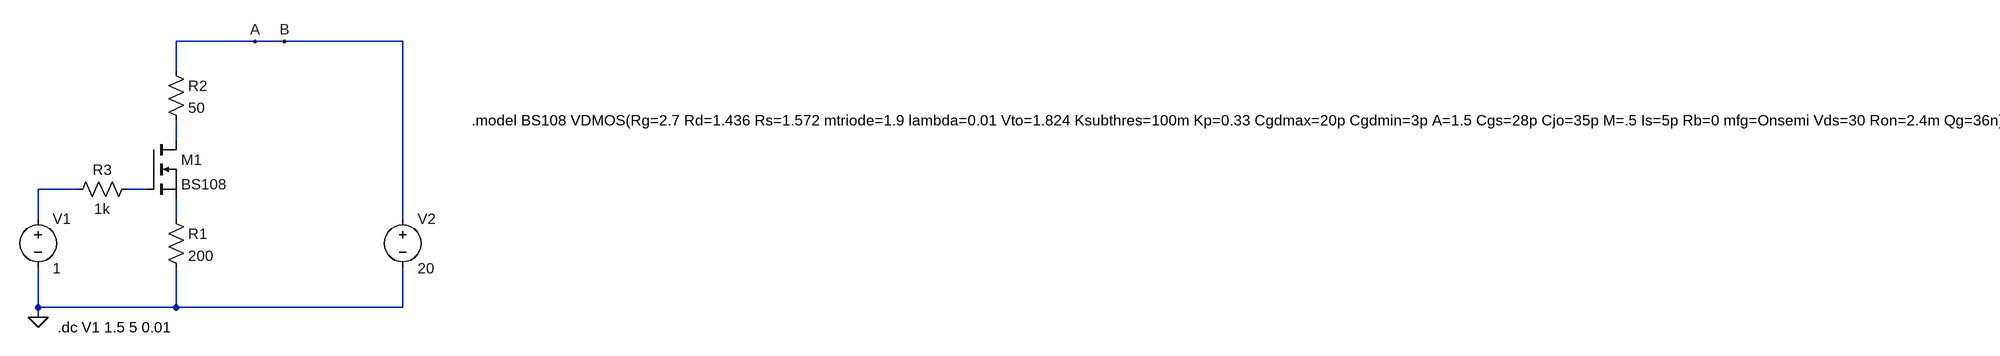
[diagram p0: schematic MOSFET.asc]
MOSFET.asc, the LTspice schematic file:
Version 4
SHEET 1 3644 680
WIRE 336 -128 208 -128
WIRE 384 -128 336 -128
WIRE 576 -128 384 -128
WIRE 208 -80 208 -128
WIRE 208 32 208 0
WIRE 48 112 -16 112
WIRE 160 112 128 112
WIRE -16 160 -16 112
WIRE 208 160 208 128
WIRE 576 160 576 -128
WIRE -16 304 -16 240
WIRE 208 304 208 240
WIRE 208 304 -16 304
WIRE 576 304 576 240
WIRE 576 304 208 304
WIRE -16 320 -16 304
FLAG -16 320 0
FLAG 336 -128 A
FLAG 384 -128 B
SYMBOL nmos 160 32 R0
SYMATTR InstName M1
SYMATTR Value BS108
SYMBOL voltage -16 144 R0
WINDOW 123 0 0 Left 0
WINDOW 39 0 0 Left 0
SYMATTR InstName V1
SYMATTR Value 1
SYMBOL voltage 576 144 R0
WINDOW 123 0 0 Left 0
WINDOW 39 0 0 Left 0
SYMATTR InstName V2
SYMATTR Value 20
SYMBOL res 192 144 R0
SYMATTR InstName R1
SYMATTR Value 200
SYMBOL res 192 -96 R0
SYMATTR InstName R2
SYMATTR Value 50
SYMBOL res 144 96 R90
WINDOW 0 0 56 VBottom 2
WINDOW 3 32 56 VTop 2
SYMATTR InstName R3
SYMATTR Value 1k
TEXT 16 336 Left 2 !.dc V1 1.5 5 0.01
TEXT 688 0 Left 2 !.model BS108 VDMOS(Rg=2.7 Rd=1.436 Rs=1.572 mtriode=1.9 lambda=0.01 Vto=1.824 Ksubthres=100m Kp=0.33 Cgdmax=20p Cgdmin=3p A=1.5 Cgs=28p Cjo=35p M=.5 Is=5p Rb=0 mfg=Onsemi Vds=30 Ron=2.4m Qg=36n)

The netlist it stands for:
* MOSFET.asc
M1 N001 N003 N004 N004 BS108
V1 N002 0 1
V2 B 0 20
R1 N004 0 200
R2 B N001 50
R3 N003 N002 1k
.model NMOS NMOS
.model PMOS PMOS
.lib standard.mos
.dc V1 1.5 5 0.01
.model BS108 VDMOS(Rg=2.7 Rd=1.436 Rs=1.572 mtriode=1.9 lambda=0.01 Vto=1.824 Ksubthres=100m Kp=0.33 Cgdmax=20p Cgdmin=3p A=1.5 Cgs=28p Cjo=35p M=.5 Is=5p Rb=0 mfg=Onsemi Vds=30 Ron=2.4m Qg=36n)
.backanno
.end